# EAGLE schematic untitled (EAGLE 9.6.2)
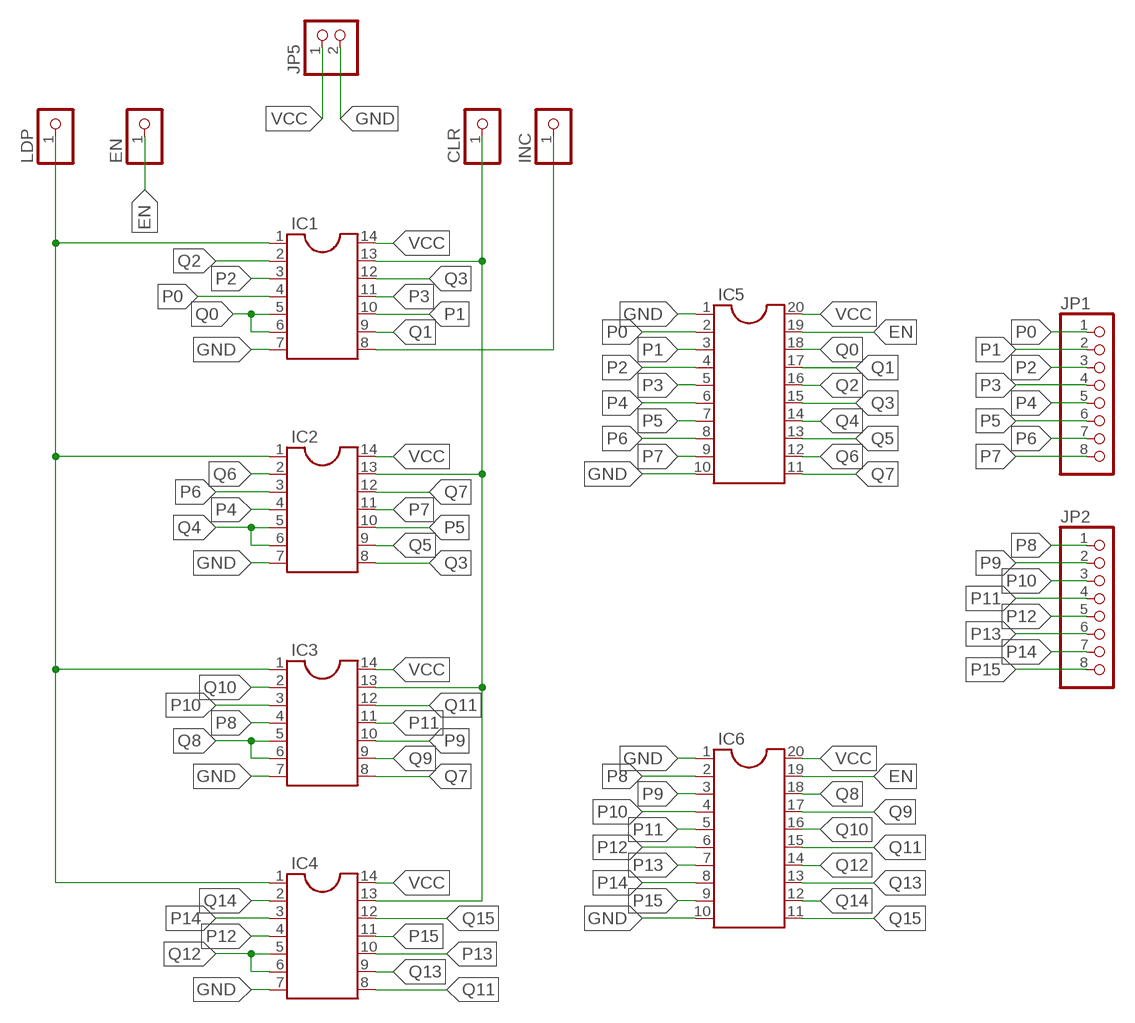
[diagram p0: schematic, sheet 1]

## Parts
CLR  PINHD-1X1  [1X01]
EN  PINHD-1X1  [1X01]
IC1  DIL14  [DIL14]
IC2  DIL14  [DIL14]
IC3  DIL14  [DIL14]
IC4  DIL14  [DIL14]
IC5  DIL20  [DIL20]
IC6  DIL20  [DIL20]
INC  PINHD-1X1  [1X01]
JP1  PINHD-1X8  [1X08]
JP2  PINHD-1X8  [1X08]
JP5  PINHD-1X2  [1X02]
LDP  PINHD-1X1  [1X01]

## Nets
EN: EN.1 IC5.19 IC6.19
GND: IC1.7 IC2.7 IC3.7 IC4.7 IC5.1 IC5.10 IC6.1 IC6.10 JP5.2
N$1: IC1.1 IC2.1 IC3.1 IC4.1 LDP.1
N$2: CLR.1 IC1.13 IC2.13 IC3.13 IC4.13
N$3: IC1.8 INC.1
P0: IC1.4 IC5.2 JP1.1
P1: IC1.10 IC5.3 JP1.2
P2: IC1.3 IC5.4 JP1.3
P3: IC1.11 IC5.5 JP1.4
P4: IC2.4 IC5.6 JP1.5
P5: IC2.10 IC5.7 JP1.6
P6: IC2.3 IC5.8 JP1.7
P7: IC2.11 IC5.9 JP1.8
P8: IC3.4 IC6.2 JP2.1
P9: IC3.10 IC6.3 JP2.2
P10: IC3.3 IC6.4 JP2.3
P11: IC3.11 IC6.5 JP2.4
P12: IC4.4 IC6.6 JP2.5
P13: IC4.10 IC6.7 JP2.6
P14: IC4.3 IC6.8 JP2.7
P15: IC4.11 IC6.9 JP2.8
Q0: IC1.5 IC1.6 IC5.18
Q1: IC1.9 IC5.17
Q2: IC1.2 IC5.16
Q3: IC1.12 IC2.8 IC5.15
Q4: IC2.5 IC2.6 IC5.14
Q5: IC2.9 IC5.13
Q6: IC2.2 IC5.12
Q7: IC2.12 IC3.8 IC5.11
Q8: IC3.5 IC3.6 IC6.18
Q9: IC3.9 IC6.17
Q10: IC3.2 IC6.16
Q11: IC3.12 IC4.8 IC6.15
Q12: IC4.5 IC4.6 IC6.14
Q13: IC4.9 IC6.13
Q14: IC4.2 IC6.12
Q15: IC4.12 IC6.11
VCC: IC1.14 IC2.14 IC3.14 IC4.14 IC5.20 IC6.20 JP5.1

## Library data of the parts
CLR EN INC LDP = pinhead:PINHD-1X1: PIN HEADER
IC1-IC4 = ic-package:DIL14: Dual In Line / Socket
IC5 IC6 = ic-package:DIL20: Dual In Line / Socket
JP1 JP2 = pinhead:PINHD-1X8: PIN HEADER
JP5 = pinhead:PINHD-1X2: PIN HEADER